# Altium schematic sheet shiftRegister.SchDoc
size A4
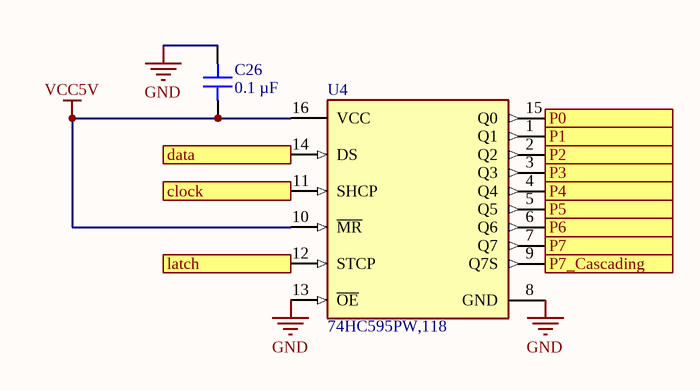
[diagram p0: shiftRegister.SchDoc]

## Parts
C26  0.1 µF  [CAP 0603_1608]
U4  74HC595PW,118  [FP-SOT403-1-MFG]

## Ports
clock, data, latch, P0, P1, P2, P3, P4, P5, P6, P7, P7_Cascading

## Nets
GND: C26.2 U4.8(GND) U4.13(~{OE})
VCC5V: C26.1 U4.10(~{MR}) U4.16(VCC)
clock: U4.11(SHCP) ; port clock
data: U4.14(DS) ; port data
latch: U4.12(STCP) ; port latch
P0: U4.15(Q0) ; port P0
P1: U4.1(Q1) ; port P1
P2: U4.2(Q2) ; port P2
P3: U4.3(Q3) ; port P3
P4: U4.4(Q4) ; port P4
P5: U4.5(Q5) ; port P5
P6: U4.6(Q6) ; port P6
P7: U4.7(Q7) ; port P7
P7_Cascading: U4.9(Q7S) ; port P7_Cascading

## Library data of the parts
C26 = C0603C104K5RAC7411: CAP CER 0.1UF 50V X7R 0603; manufacturer: KEMET; Tolerance: ±10%; Part Number: C0603C104K5RAC7411; Value: 0.1 µF; Applications: Bypass, Decoupling; Capacitance: 0.1 µF; componentlink1description: Datasheet; componentlink1url: https://api.kemet.com/component-edge/download/datasheet/C0603C104K5RAC7411.pdf; componentlink2description: DigiKey Link; componentlink2url: https://www.digikey.com/en/products/detail/kemet/C0603C104K5RAC7411/3317013; Device Package: 0603 (1608 Metric); lastupdated: 2023-06-20 7:12:54 PM; Lifecycle Status: Active; Minimum Order: 1; Mounting Type: Surface Mount, MLCC; Operating Temperature: -55°C ~ 125°C; Package / Case: 0603 (1608 Metric); packaging: TapeAndReel; partid: 2233; Part Status: Active; price: 0.01; series: SMD Comm X7R; Size / Dimension: 0.063" L x 0.031" W (1.60mm x 0.80mm); Supplier 1: DigiKey; Supplier Part Number 1: 399-C0603C104K5RAC7411CT-ND; Temperature Coefficient: X7R; Thickness (Max): 0.035" (0.90mm); Voltage - Rated: 50V
U4 = CMP-14351-000004-1: IC SHIFT REGISTER 8BIT 16TSSOP